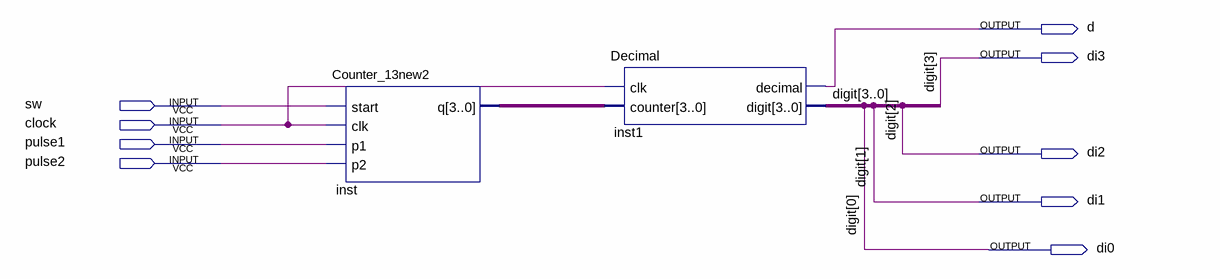
[diagram p0: schematic sheet]
// Quartus schematic Project.bdf as structural Verilog: 2 symbols, 9 pins
module Project (
  input  sw,
  input  clock,
  input  pulse1,
  input  pulse2,
  output d,
  output di3,
  output di2,
  output di1,
  output di0
);

  wire [3:0] inst_q;

  Counter_13new2 inst (.start(sw), .clk(clock), .p1(pulse1), .p2(pulse2), .q(inst_q));
  Decimal inst1 (.clk(clock), .counter(inst_q), .decimal(d), .digit({di3, di2, di1, di0}));

  // Other names for the same wires on the sheet: digit[3:0] = {di3, di2, di1, di0}
endmodule
